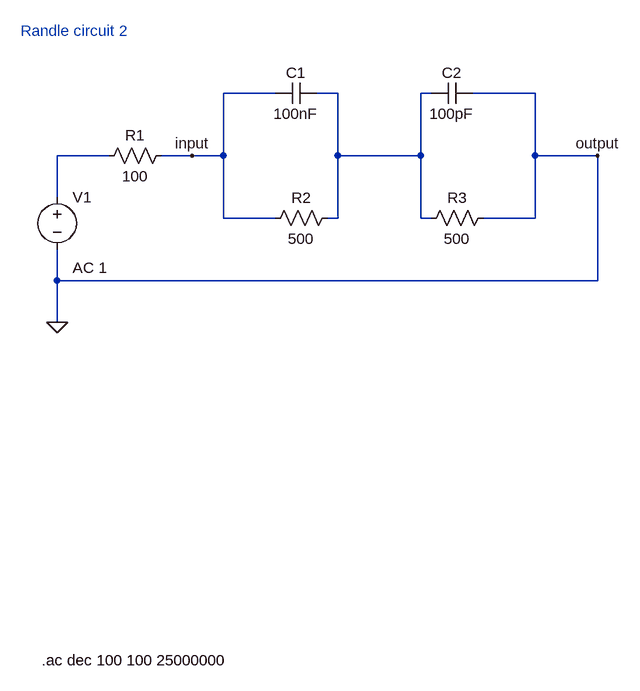
[diagram p0: schematic randle circuit 2 alt.asc]
randle circuit 2 alt.asc, the LTspice schematic file:
Version 4
SHEET 1 880 920
WIRE 96 32 16 32
WIRE 192 32 160 32
WIRE 336 32 320 32
WIRE 496 32 400 32
WIRE -160 128 -240 128
WIRE -32 128 -80 128
WIRE 16 128 16 32
WIRE 16 128 -32 128
WIRE 192 128 192 32
WIRE 320 128 320 32
WIRE 320 128 192 128
WIRE 496 128 496 32
WIRE 592 128 496 128
WIRE -240 192 -240 128
WIRE 16 224 16 128
WIRE 96 224 16 224
WIRE 192 224 192 128
WIRE 192 224 176 224
WIRE 320 224 320 128
WIRE 336 224 320 224
WIRE 496 224 496 128
WIRE 496 224 416 224
WIRE -240 320 -240 272
WIRE 592 320 592 128
WIRE 592 320 -240 320
WIRE -240 384 -240 320
FLAG -240 384 0
FLAG 592 128 output
FLAG -32 128 input
SYMBOL res -64 112 R90
WINDOW 0 0 56 VBottom 2
WINDOW 3 32 56 VTop 2
SYMATTR InstName R1
SYMATTR Value 100
SYMBOL res 192 208 R90
WINDOW 0 0 56 VBottom 2
WINDOW 3 32 56 VTop 2
SYMATTR InstName R2
SYMATTR Value 500
SYMBOL res 432 208 R90
WINDOW 0 0 56 VBottom 2
WINDOW 3 32 56 VTop 2
SYMATTR InstName R3
SYMATTR Value 500
SYMBOL cap 160 16 R90
WINDOW 0 0 32 VBottom 2
WINDOW 3 32 32 VTop 2
SYMATTR InstName C1
SYMATTR Value 100nF
SYMBOL cap 400 16 R90
WINDOW 0 0 32 VBottom 2
WINDOW 3 32 32 VTop 2
SYMATTR InstName C2
SYMATTR Value 100pF
SYMBOL voltage -240 176 R0
WINDOW 123 24 124 Left 2
WINDOW 39 0 0 Left 0
SYMATTR Value2 AC 1
SYMATTR InstName V1
SYMATTR Value ""
TEXT -296 -64 Left 2 ;Randle circuit 2
TEXT -264 904 Left 2 !.ac dec 100 100 25000000

The netlist it stands for:
* randle circuit 2 alt.asc
R1 input N002 100
R2 N001 input 500
R3 0 N001 500
C1 N001 input 100nF
C2 0 N001 100pF
V1 N002 0 AC 1
* Randle circuit 2
.ac dec 100 100 25000000
.backanno
.end